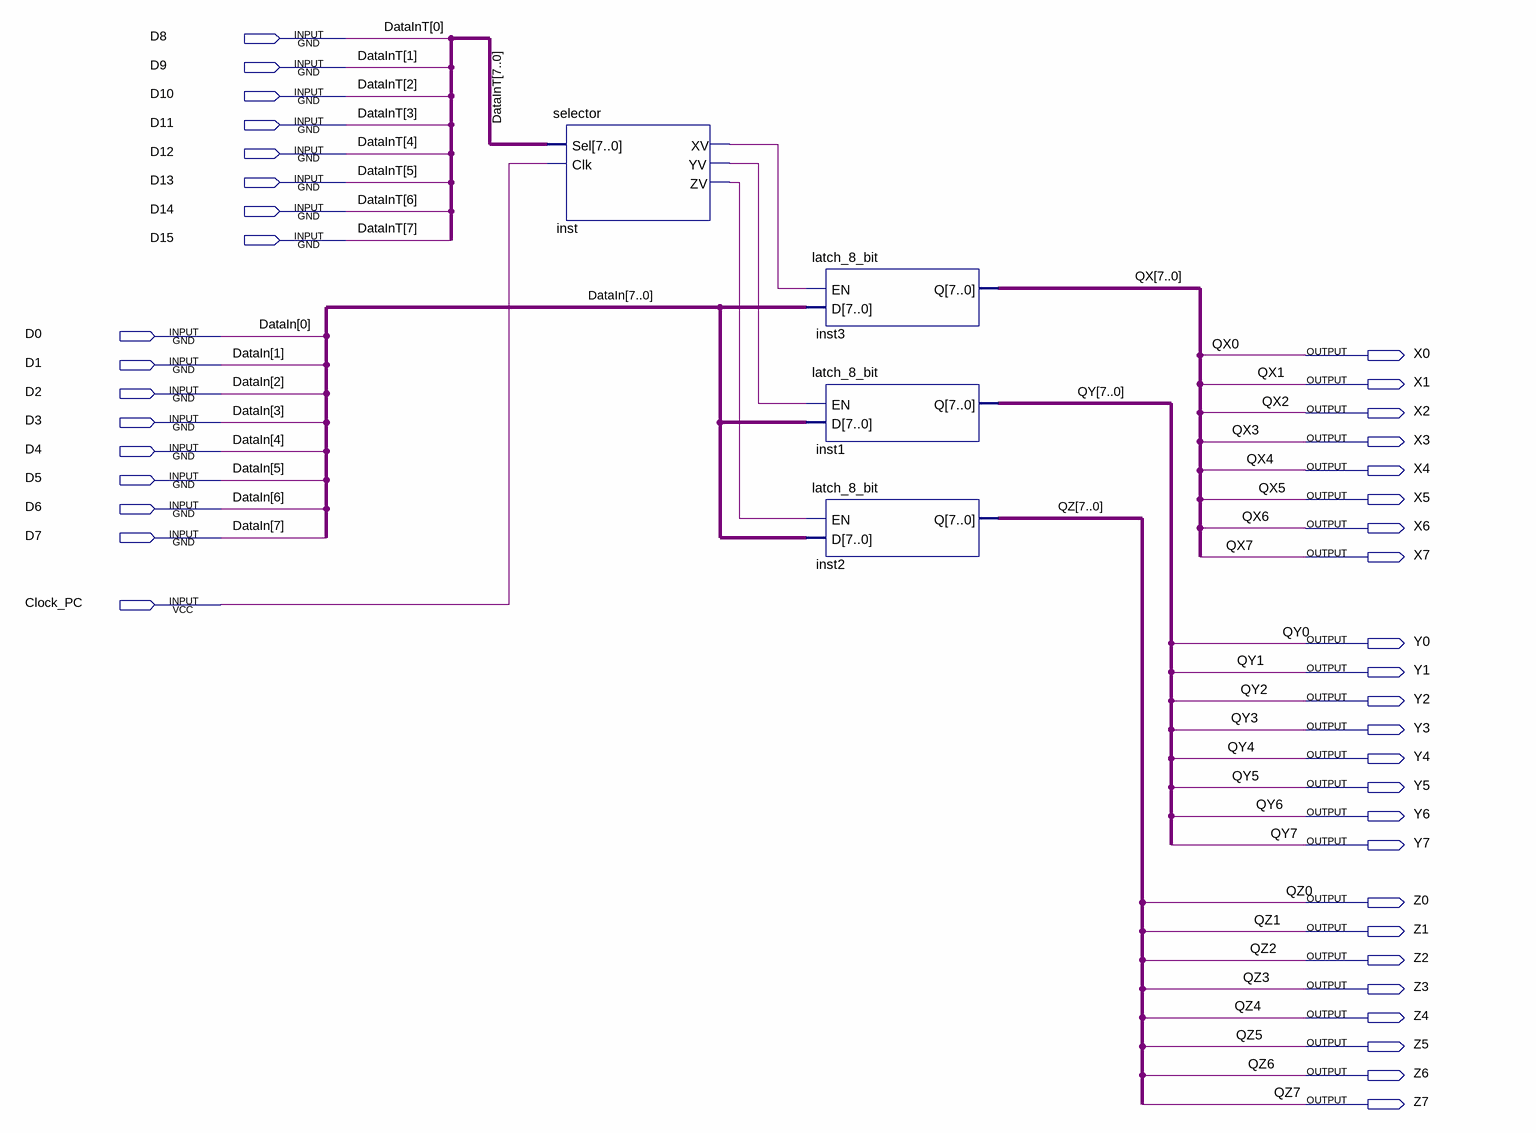
[diagram p0: schematic sheet]
// Quartus schematic demux_latch_test.bdf as structural Verilog: 4 symbols, 41 pins
module demux_latch_test (
  input  D8,
  input  D9,
  input  D10,
  input  D11,
  input  D12,
  input  D13,
  input  D14,
  input  D15,
  input  D0,
  input  D1,
  input  D2,
  input  D3,
  input  D4,
  input  D5,
  input  D6,
  input  D7,
  input  Clock_PC,
  output X0,
  output X1,
  output X2,
  output X3,
  output X4,
  output X5,
  output X6,
  output X7,
  output Y0,
  output Y1,
  output Y2,
  output Y3,
  output Y4,
  output Y5,
  output Y6,
  output Y7,
  output Z0,
  output Z1,
  output Z2,
  output Z3,
  output Z4,
  output Z5,
  output Z6,
  output Z7
);

  wire inst_xv, inst_yv, inst_zv;

  selector inst (
    .Sel({D15, D14, D13, D12, D11, D10, D9, D8}), .Clk(Clock_PC), .XV(inst_xv), .YV(inst_yv), .ZV(inst_zv));
  latch_8_bit inst3 (.EN(inst_xv), .D({D7, D6, D5, D4, D3, D2, D1, D0}), .Q({X7, X6, X5, X4, X3, X2, X1, X0}));
  latch_8_bit inst1 (.EN(inst_yv), .D({D7, D6, D5, D4, D3, D2, D1, D0}), .Q({Y7, Y6, Y5, Y4, Y3, Y2, Y1, Y0}));
  latch_8_bit inst2 (.EN(inst_zv), .D({D7, D6, D5, D4, D3, D2, D1, D0}), .Q({Z7, Z6, Z5, Z4, Z3, Z2, Z1, Z0}));

  // Other names for the same wires on the sheet: DataIn[7:0] = {D7, D6, D5, D4, D3, D2, D1, D0};
  //   DataInT[7:0] = {D15, D14, D13, D12, D11, D10, D9, D8}; QX[7:0] = {X7, X6, X5, X4, X3, X2, X1, X0}; QX0 = X0;
  //   QX1 = X1; QX2 = X2; QX3 = X3; QX4 = X4; QX5 = X5; QX6 = X6; QX7 = X7;
  //   QY[7:0] = {Y7, Y6, Y5, Y4, Y3, Y2, Y1, Y0}; QY0 = Y0; QY1 = Y1; QY2 = Y2; QY3 = Y3; QY4 = Y4; QY5 = Y5;
  //   QY6 = Y6; QY7 = Y7; QZ[7:0] = {Z7, Z6, Z5, Z4, Z3, Z2, Z1, Z0}; QZ0 = Z0; QZ1 = Z1; QZ2 = Z2; QZ3 = Z3;
  //   QZ4 = Z4; QZ5 = Z5; QZ6 = Z6; QZ7 = Z7
endmodule
